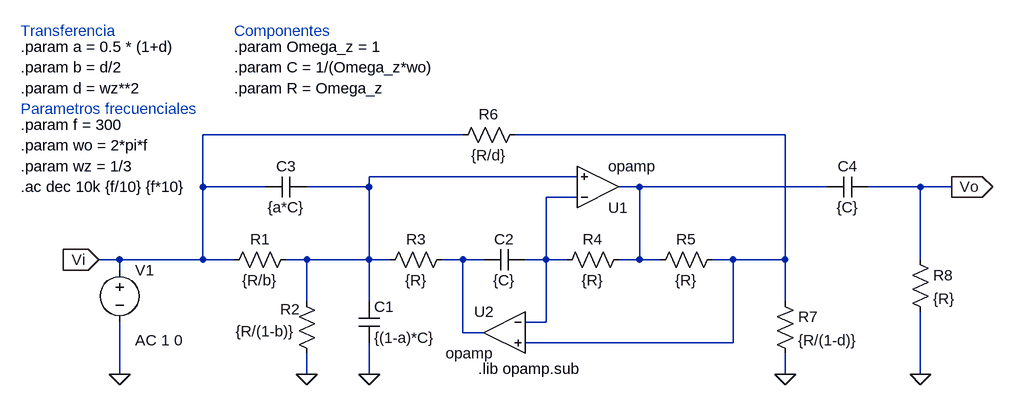
[diagram p0: schematic TS5_Schaumann.asc]
TS5_Schaumann.asc, the LTspice schematic file:
Version 4
SHEET 1 1532 680
WIRE 688 -80 288 -80
WIRE 1184 -80 768 -80
WIRE 864 -16 544 -16
WIRE 288 0 288 -80
WIRE 384 0 288 0
WIRE 544 0 544 -16
WIRE 544 0 448 0
WIRE 960 0 928 0
WIRE 1248 0 960 0
WIRE 1392 0 1312 0
WIRE 1440 0 1392 0
WIRE 864 16 816 16
WIRE 160 112 128 112
WIRE 288 112 288 0
WIRE 288 112 160 112
WIRE 336 112 288 112
WIRE 448 112 416 112
WIRE 544 112 544 0
WIRE 544 112 448 112
WIRE 576 112 544 112
WIRE 688 112 656 112
WIRE 720 112 688 112
WIRE 816 112 816 16
WIRE 816 112 784 112
WIRE 848 112 816 112
WIRE 960 112 960 0
WIRE 960 112 928 112
WIRE 992 112 960 112
WIRE 1104 112 1072 112
WIRE 1184 112 1184 -80
WIRE 1184 112 1104 112
WIRE 1392 112 1392 0
WIRE 160 128 160 112
WIRE 448 176 448 112
WIRE 544 176 544 112
WIRE 1184 176 1184 112
WIRE 816 208 816 112
WIRE 816 208 784 208
WIRE 688 224 688 112
WIRE 720 224 688 224
WIRE 1104 240 1104 112
WIRE 1104 240 784 240
WIRE 160 288 160 208
WIRE 448 288 448 256
WIRE 544 288 544 240
WIRE 1184 288 1184 256
WIRE 1392 288 1392 192
FLAG 1440 0 Vo
IOPIN 1440 0 Out
FLAG 128 112 Vi
IOPIN 128 112 In
FLAG 544 288 0
FLAG 1184 288 0
FLAG 448 288 0
FLAG 160 288 0
FLAG 1392 288 0
SYMBOL OpAmps\\opamp 896 64 M180
SYMATTR InstName U1
SYMBOL OpAmps\\opamp 752 160 M0
SYMATTR InstName U2
SYMBOL res 672 96 R90
WINDOW 0 0 56 VBottom 2
WINDOW 3 32 56 VTop 2
SYMATTR InstName R3
SYMATTR Value {R}
SYMBOL res 944 96 R90
WINDOW 0 0 56 VBottom 2
WINDOW 3 32 56 VTop 2
SYMATTR InstName R4
SYMATTR Value {R}
SYMBOL cap 784 96 R90
WINDOW 0 0 32 VBottom 2
WINDOW 3 32 32 VTop 2
SYMATTR InstName C2
SYMATTR Value {C}
SYMBOL cap 528 176 R0
SYMATTR InstName C1
SYMATTR Value {(1-a)*C}
SYMBOL res 432 96 R90
WINDOW 0 0 56 VBottom 2
WINDOW 3 32 56 VTop 2
SYMATTR InstName R1
SYMATTR Value {R/b}
SYMBOL cap 448 -16 R90
WINDOW 0 0 32 VBottom 2
WINDOW 3 32 32 VTop 2
SYMATTR InstName C3
SYMATTR Value {a*C}
SYMBOL res 1168 160 R0
SYMATTR InstName R7
SYMATTR Value {R/(1-d)}
SYMBOL res 784 -96 R90
WINDOW 0 0 56 VBottom 2
WINDOW 3 32 56 VTop 2
SYMATTR InstName R6
SYMATTR Value {R/d}
SYMBOL res 432 160 R0
WINDOW 0 -25 28 Left 2
WINDOW 3 -93 62 Left 2
SYMATTR InstName R2
SYMATTR Value {R/(1-b)}
SYMBOL voltage 160 112 R0
WINDOW 123 24 124 Left 2
WINDOW 39 0 0 Left 0
SYMATTR Value2 AC 1 0
SYMATTR InstName V1
SYMATTR Value ""
SYMBOL res 1376 96 R0
SYMATTR InstName R8
SYMATTR Value {R}
SYMBOL cap 1312 -16 R90
WINDOW 0 0 32 VBottom 2
WINDOW 3 32 32 VTop 2
SYMATTR InstName C4
SYMATTR Value {C}
SYMBOL res 1088 96 R90
WINDOW 0 0 56 VBottom 2
WINDOW 3 32 56 VTop 2
SYMATTR InstName R5
SYMATTR Value {R}
TEXT 8 -64 Left 2 !.param wo = 2*pi*f
TEXT 8 -96 Left 2 !.param f = 300
TEXT 336 -184 Left 2 !.param C = 1/(Omega_z*wo)
TEXT 8 0 Left 2 !.ac dec 10k {f/10} {f*10}
TEXT 8 -120 Left 2 ;Parametros frecuenciales
TEXT 336 -240 Left 2 ;Componentes
TEXT 336 -216 Left 2 !.param Omega_z = 1
TEXT 336 -152 Left 2 !.param R = Omega_z
TEXT 8 -32 Left 2 !.param wz = 1/3
TEXT 8 -240 Left 2 ;Transferencia
TEXT 8 -216 Left 2 !.param a = 0.5 * (1+d)
TEXT 8 -184 Left 2 !.param b = d/2
TEXT 8 -152 Left 2 !.param d = wz**2
TEXT 712 280 Left 2 !.lib opamp.sub

The netlist it stands for:
* TS5_Schaumann.asc
XU1 N004 N002 N003 opamp Aol=100K GBW=10Meg  ; pins invin noninvin out
XU2 N004 N001 N005 opamp Aol=100K GBW=10Meg  ; pins invin noninvin out
R3 N005 N002 {R}
R4 N003 N004 {R}
C2 N004 N005 {C}
C1 N002 0 {(1-a)*C}
R1 N002 Vi {R/b}
C3 N002 Vi {a*C}
R7 N001 0 {R/(1-d)}
R6 N001 Vi {R/d}
R2 N002 0 {R/(1-b)}
V1 Vi 0 AC 1 0
R8 Vo 0 {R}
C4 Vo N003 {C}
R5 N001 N003 {R}
.param wo = 2*pi*f
.param f = 300
.param C = 1/(Omega_z*wo)
.ac dec 10k {f/10} {f*10}
* Parametros frecuenciales
* Componentes
.param Omega_z = 1
.param R = Omega_z
.param wz = 1/3
* Transferencia
.param a = 0.5 * (1+d)
.param b = d/2
.param d = wz**2
.lib opamp.sub
.backanno
.end